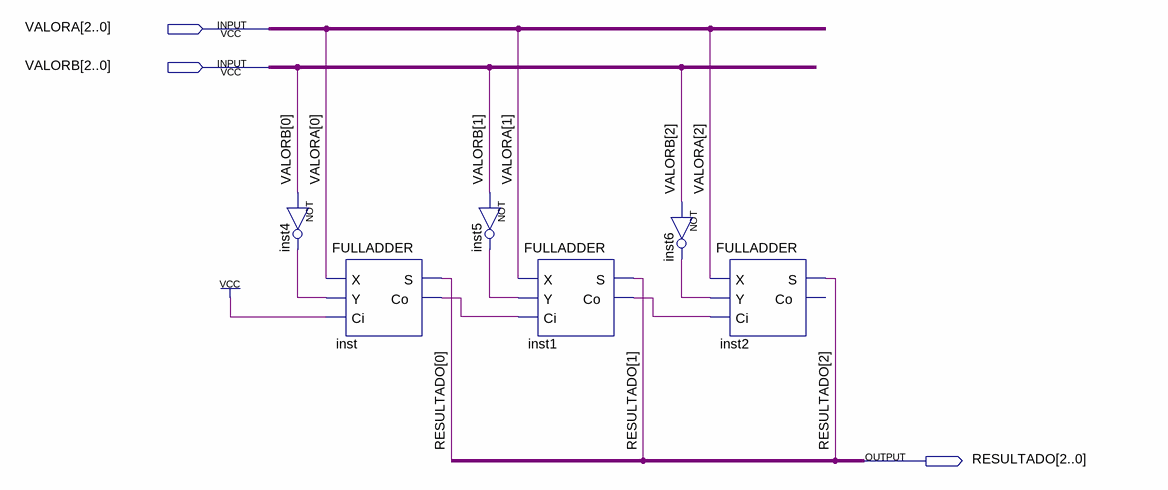
[diagram p0: schematic sheet]
// Quartus schematic RESTADOR3BITS.bdf as structural Verilog: 6 symbols, 3 pins
module RESTADOR3BITS (
  input  [2:0] VALORA,
  input  [2:0] VALORB,
  output [2:0] RESULTADO
);

  wire inst1_co, inst4_out, inst5_out, inst6_out, inst_co;

  not inst4 (inst4_out, VALORB[0]);
  FULLADDER inst (.X(VALORA[0]), .Y(inst4_out), .Ci(1'b1), .S(RESULTADO[0]), .Co(inst_co));
  not inst5 (inst5_out, VALORB[1]);
  FULLADDER inst1 (.X(VALORA[1]), .Y(inst5_out), .Ci(inst_co), .S(RESULTADO[1]), .Co(inst1_co));
  not inst6 (inst6_out, VALORB[2]);
  FULLADDER inst2 (.X(VALORA[2]), .Y(inst6_out), .Ci(inst1_co), .S(RESULTADO[2]));  // open: Co
endmodule
